# Altium schematic sheet CurrentSensor.SchDoc
size A; SheetNumber: 2; SheetTotal: 5
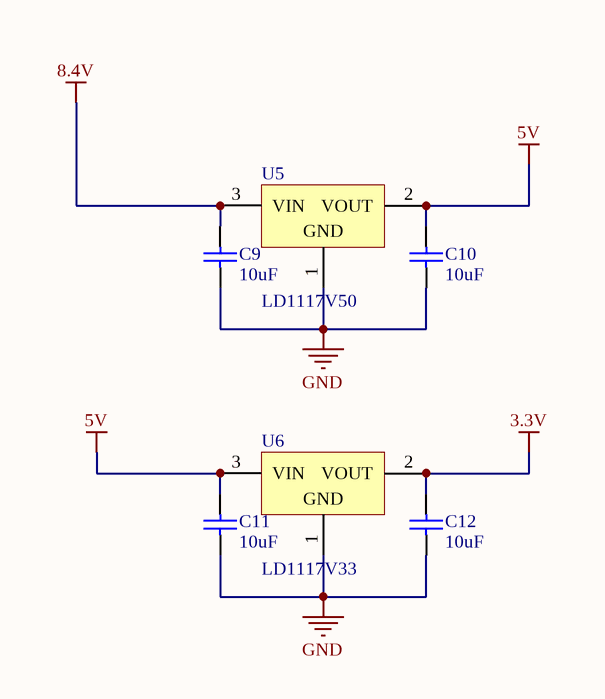
[diagram p0: CurrentSensor.SchDoc]

## Parts
C9  10uF  [CAPC2013X145X48ML20T23]
C10  10uF  [CAPC2013X145X48ML20T23]
C11  10uF  [CAPC2013X145X48ML20T23]
C12  10uF  [CAPC2013X145X48ML20T23]
U5  LD1117V50  [TO220]
U6  LD1117V33  [TO220]

## Nets
3.3V: C12.1 U6.2(VOUT)
5V: C10.1 C11.1 U5.2(VOUT) U6.3(VIN)
8.4V: C9.1 U5.3(VIN)
GND: C9.2 C10.2 C11.2 C12.2 U5.1(GND) U6.1(GND)

## Library data of the parts
C9-C12 = CMP-2007-03160-1: Part Number: VJ0805Y103KXBBC31; Manufacturer: Vitramon
U5 = CMP-0244-00472-1: Fixed Low Drop Positive Voltage Regulator, 5V, 3-Pin TO-220; ComponentLink1URL: http://www.st.com; ComponentLink1Description: Manufacturer URL; DatasheetVersion: 1/11/2011; PackageDescription: TO, Thru-Hole, Vertical, Heatsink Mounted; 3 In-Line Leads; Pitch 2.54 mm; ComponentLink2Description: Datasheet; ComponentLink3URL: http://www.st.com/internet/com/TECHNICAL_RESOURCES/TECHNICAL_LITERATURE/PACKAGE_INFORMATION/CD00004649.pdf; PackageVersion: ver3.0; PackageReference: TO220; ComponentLink2URL: http://www.st.com/internet/com/TECHNICAL_RESOURCES/TECHNICAL_LITERATURE/DATASHEET/CD00000544.pdf; ComponentLink3Description: Package Specification
U6 = CMP-0244-00470-1: Fixed Low Drop Positive Voltage Regulator, 3.3V, 3-Pin TO-220; PackageVersion: ver3.0; PackageDescription: TO, Thru-Hole, Vertical, Heatsink Mounted; 3 In-Line Leads; Pitch 2.54 mm; ComponentLink1Description: Manufacturer URL; ComponentLink3URL: http://www.st.com/internet/com/TECHNICAL_RESOURCES/TECHNICAL_LITERATURE/PACKAGE_INFORMATION/CD00004649.pdf; PackageReference: TO220; ComponentLink2URL: http://www.st.com/internet/com/TECHNICAL_RESOURCES/TECHNICAL_LITERATURE/DATASHEET/CD00000544.pdf; ComponentLink3Description: Package Specification; ComponentLink2Description: Datasheet; ComponentLink1URL: http://www.st.com; DatasheetVersion: 1/11/2011